# Altium schematic sheet mikrokontroler.SchDoc
size A4
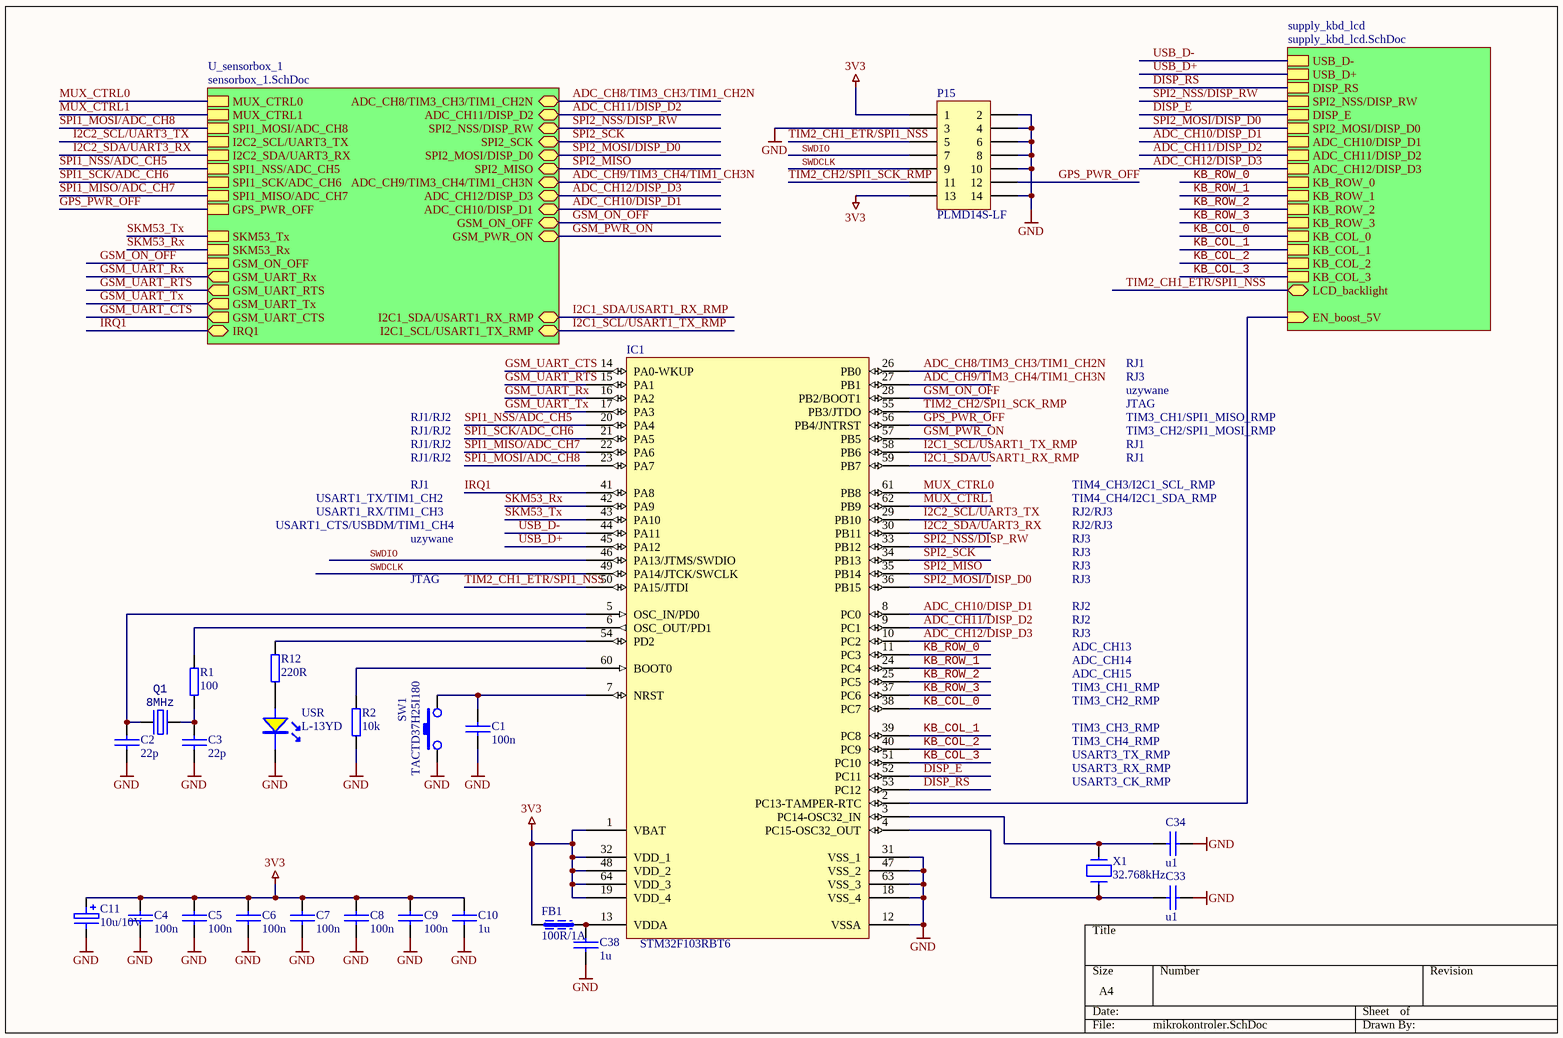
[diagram p0: mikrokontroler.SchDoc]

## Parts
C1  100n  [0603C]
C2  22p  [0603C]
C3  22p  [0603C]
C4  100n  [0603C]
C5  100n  [0603C]
C6  100n  [0603C]
C7  100n  [0603C]
C8  100n  [0603C]
C9  100n  [0603C]
C10  1u  [0603C]
C11  10u/10V  [1411_SMDB]
C33  u1  [0603]
C34  u1  [0603]
C38  1u  [0603C]
FB1  100R/1A  [0603L]
IC1  STM32F103RBT6  [LQFP64_N]
P15  PLMD14S-LF  [HDR2X7H]
Q1  8MHz  [HC-49SM]
R1  100  [0603R]
R2  10k  [0603R]
R12  220R  [0603R]
SW1  TACTD37H25I180  [TACTD37H25I180]
USR  L-13YD  [LED_L-13YD]
X1  32.768kHz  [crystal_85SMX]

## Sub-sheets
supply_kbd_lcd = supply_kbd_lcd.SchDoc: USB_D-, USB_D+, DISP_RS, SPI2_NSS/DISP_RW, DISP_E, SPI2_MOSI/DISP_D0, ADC_CH10/DISP_D1, ADC_CH11/DISP_D2, ADC_CH12/DISP_D3, KB_ROW_0, KB_ROW_1, KB_ROW_2, KB_ROW_3, KB_COL_0, KB_COL_1, KB_COL_2, KB_COL_3, LCD_backlight, EN_boost_5V (in)
U_sensorbox_1 = sensorbox_1.SchDoc: MUX_CTRL0, MUX_CTRL1, SPI1_MOSI/ADC_CH8, I2C2_SCL/UART3_TX, I2C2_SDA/UART3_RX, SPI1_NSS/ADC_CH5, SPI1_SCK/ADC_CH6, SPI1_MISO/ADC_CH7, GPS_PWR_OFF, SKM53_Tx, SKM53_Rx, GSM_UART_Rx (out), GSM_UART_RTS (out), GSM_UART_Tx (out), GSM_UART_CTS (out), GSM_ON_OFF, IRQ1, I2C1_SDA/USART1_RX_RMP, I2C1_SCL/USART1_TX_RMP, ADC_CH8/TIM3_CH3/TIM1_CH2N, ADC_CH11/DISP_D2, SPI2_NSS/DISP_RW, SPI2_SCK, SPI2_MOSI/DISP_D0, ADC_CH9/TIM3_CH4/TIM1_CH3N, ADC_CH12/DISP_D3, ADC_CH10/DISP_D1, GSM_ON_OFF, SPI2_MISO, GSM_PWR_ON

## Nets
3V3: C4.1 C5.1 C6.1 C7.1 C8.1 C9.1 C10.1 C11.1 FB1.1 IC1.1(VBAT) IC1.19(VDD_4) IC1.32(VDD_1) IC1.48(VDD_2) IC1.64(VDD_3) P15.1 P15.13
GND: C1.2 C2.2 C3.2 C4.2 C5.2 C6.2 C7.2 C8.2 C9.2 C10.2 C11.2 C33.2 C34.2 C38.2 IC1.12(VSSA) IC1.18(VSS_4) IC1.31(VSS_1) IC1.47(VSS_2) IC1.63(VSS_3) P15.2 P15.3 P15.4 P15.6 P15.8 P15.10 P15.14 R2.2 SW1.1 USR.K
ADC_CH8/TIM3_CH3/TIM1_CH2N: IC1.26(PB0) ; sheet U_sensorbox_1/ADC_CH8/TIM3_CH3/TIM1_CH2N
ADC_CH9/TIM3_CH4/TIM1_CH3N: IC1.27(PB1) ; sheet U_sensorbox_1/ADC_CH9/TIM3_CH4/TIM1_CH3N
ADC_CH10/DISP_D1: IC1.8(PC0) ; sheet supply_kbd_lcd/ADC_CH10/DISP_D1, sheet U_sensorbox_1/ADC_CH10/DISP_D1
ADC_CH11/DISP_D2: IC1.9(PC1) ; sheet supply_kbd_lcd/ADC_CH11/DISP_D2, sheet U_sensorbox_1/ADC_CH11/DISP_D2
ADC_CH12/DISP_D3: IC1.10(PC2) ; sheet supply_kbd_lcd/ADC_CH12/DISP_D3, sheet U_sensorbox_1/ADC_CH12/DISP_D3
DISP_E: IC1.52(PC11) ; sheet supply_kbd_lcd/DISP_E
DISP_RS: IC1.53(PC12) ; sheet supply_kbd_lcd/DISP_RS
GPS_PWR_OFF: IC1.56(PB4/JNTRST) P15.12 ; sheet U_sensorbox_1/GPS_PWR_OFF
GSM_ON_OFF: IC1.28(PB2/BOOT1) ; sheet U_sensorbox_1/GSM_ON_OFF, sheet U_sensorbox_1/GSM_ON_OFF
GSM_PWR_ON: IC1.57(PB5) ; sheet U_sensorbox_1/GSM_PWR_ON
GSM_UART_CTS: IC1.14(PA0-WKUP) ; sheet U_sensorbox_1/GSM_UART_CTS
GSM_UART_RTS: IC1.15(PA1) ; sheet U_sensorbox_1/GSM_UART_RTS
GSM_UART_Rx: IC1.16(PA2) ; sheet U_sensorbox_1/GSM_UART_Rx
GSM_UART_Tx: IC1.17(PA3) ; sheet U_sensorbox_1/GSM_UART_Tx
I2C1_SCL/USART1_TX_RMP: IC1.58(PB6) ; sheet U_sensorbox_1/I2C1_SCL/USART1_TX_RMP
I2C1_SDA/USART1_RX_RMP: IC1.59(PB7) ; sheet U_sensorbox_1/I2C1_SDA/USART1_RX_RMP
I2C2_SCL/UART3_TX: IC1.29(PB10) ; sheet U_sensorbox_1/I2C2_SCL/UART3_TX
I2C2_SDA/UART3_RX: IC1.30(PB11) ; sheet U_sensorbox_1/I2C2_SDA/UART3_RX
IRQ1: IC1.41(PA8) ; sheet U_sensorbox_1/IRQ1
KB_COL_0: IC1.38(PC7) ; sheet supply_kbd_lcd/KB_COL_0
KB_COL_1: IC1.39(PC8) ; sheet supply_kbd_lcd/KB_COL_1
KB_COL_2: IC1.40(PC9) ; sheet supply_kbd_lcd/KB_COL_2
KB_COL_3: IC1.51(PC10) ; sheet supply_kbd_lcd/KB_COL_3
KB_ROW_0: IC1.11(PC3) ; sheet supply_kbd_lcd/KB_ROW_0
KB_ROW_1: IC1.24(PC4) ; sheet supply_kbd_lcd/KB_ROW_1
KB_ROW_2: IC1.25(PC5) ; sheet supply_kbd_lcd/KB_ROW_2
KB_ROW_3: IC1.37(PC6) ; sheet supply_kbd_lcd/KB_ROW_3
MUX_CTRL0: IC1.61(PB8) ; sheet U_sensorbox_1/MUX_CTRL0
MUX_CTRL1: IC1.62(PB9) ; sheet U_sensorbox_1/MUX_CTRL1
SKM53_Rx: IC1.42(PA9) ; sheet U_sensorbox_1/SKM53_Rx
SKM53_Tx: IC1.43(PA10) ; sheet U_sensorbox_1/SKM53_Tx
SPI1_MISO/ADC_CH7: IC1.22(PA6) ; sheet U_sensorbox_1/SPI1_MISO/ADC_CH7
SPI1_MOSI/ADC_CH8: IC1.23(PA7) ; sheet U_sensorbox_1/SPI1_MOSI/ADC_CH8
SPI1_NSS/ADC_CH5: IC1.20(PA4) ; sheet U_sensorbox_1/SPI1_NSS/ADC_CH5
SPI1_SCK/ADC_CH6: IC1.21(PA5) ; sheet U_sensorbox_1/SPI1_SCK/ADC_CH6
SPI2_MISO: IC1.35(PB14) ; sheet U_sensorbox_1/SPI2_MISO
SPI2_MOSI/DISP_D0: IC1.36(PB15) ; sheet supply_kbd_lcd/SPI2_MOSI/DISP_D0, sheet U_sensorbox_1/SPI2_MOSI/DISP_D0
SPI2_NSS/DISP_RW: IC1.33(PB12) ; sheet supply_kbd_lcd/SPI2_NSS/DISP_RW, sheet U_sensorbox_1/SPI2_NSS/DISP_RW
SPI2_SCK: IC1.34(PB13) ; sheet U_sensorbox_1/SPI2_SCK
SWDCLK: IC1.49(PA14/JTCK/SWCLK) P15.9
SWDIO: IC1.46(PA13/JTMS/SWDIO) P15.7
TIM2_CH1_ETR/SPI1_NSS: IC1.50(PA15/JTDI) P15.5 ; sheet supply_kbd_lcd/LCD_backlight
TIM2_CH2/SPI1_SCK_RMP: IC1.55(PB3/JTDO) P15.11
USB_D+: IC1.45(PA12) ; sheet supply_kbd_lcd/USB_D+
USB_D-: IC1.44(PA11) ; sheet supply_kbd_lcd/USB_D-
NetC1_1: C1.1 IC1.7(NRST) SW1.2
NetC2_1: C2.1 IC1.5(OSC_IN/PD0) Q1.2(OSC2)
NetC3_1: C3.1 Q1.1(OSC1) R1.1
NetC33_1: C33.1 IC1.4(PC15-OSC32_OUT) X1.1
NetC34_1: C34.1 IC1.3(PC14-OSC32_IN) X1.2
NetC38_1: C38.1 FB1.2 IC1.13(VDDA)
NetIC1_2: IC1.2(PC13-TAMPER-RTC) ; sheet supply_kbd_lcd/EN_boost_5V
NetIC1_6: IC1.6(OSC_OUT/PD1) R1.2
NetIC1_54: IC1.54(PD2) R12.1
NetIC1_60: IC1.60(BOOT0) R2.1
NetR12_2: R12.2 USR.A

## Notes on the sheet
- RJ1
- RJ3
- RJ1/RJ2
- JTAG
- TIM3_CH1/SPI1_MISO_RMP
- TIM3_CH2/SPI1_MOSI_RMP
- uzywane
- USART1_TX/TIM1_CH2
- USART1_RX/TIM1_CH3
- TIM4_CH3/I2C1_SCL_RMP
- TIM4_CH4/I2C1_SDA_RMP
- RJ2/RJ3
- USART1_CTS/USBDM/TIM1_CH4
- RJ2
- ADC_CH13
- ADC_CH14
- ADC_CH15
- TIM3_CH1_RMP
- TIM3_CH2_RMP
- TIM3_CH3_RMP
- TIM3_CH4_RMP
- USART3_TX_RMP
- USART3_RX_RMP
- USART3_CK_RMP

## Library data of the parts
C1-C10 C33 C34 C38 = CAP_general: Capacitor
C11 = CAP_TANTALIUM: Tantalium Capacitor
FB1 = L_FERRITE_BEAD_0603: ferrite bead 100R@100MHz 1A
IC1 = STM32F103RBT6: STM32 ARM-based 32-bit MCU with 128 Kbytes Flash, 64-pin LQFP, Industrial Temperature; Published: 30-May-2008; DatasheetVersion: rev6, Mar-2008; PackageVersion: Mar-2008; PackageReference: LQFP64; Publisher: Altium Limited; PackageDescription: 64-Pin Low-Profile Quad Flat Pack, 10 x 10 mm Body, 0.5 mm Pitch (LQFP64); ComponentLink1Description: Manufacturer Link; ComponentLink1URL: www.st.com/stm32; ComponentLink2Description: Datasheet; ComponentLink2URL: http://www.st.com/stonline/products/literature/ds/13587.pdf
P15 = Header 7X2H: Header, 7-Pin, Dual row, Right Angle; LatestRevisionDate: 17-Jul-2002; LatestRevisionNote: Re-released for DXP Platform.; Publisher: Altium Limited
Q1 = Quartz Crystal: Farnell: 1842268
R1 R2 R12 = RES_0603: SMD Resistor
SW1 = SW-TACT_SMD: Push button
USR = LED_THT_2mm_Y: LED (TME)
X1 = X_CRYSTAL: Crystal oscillator